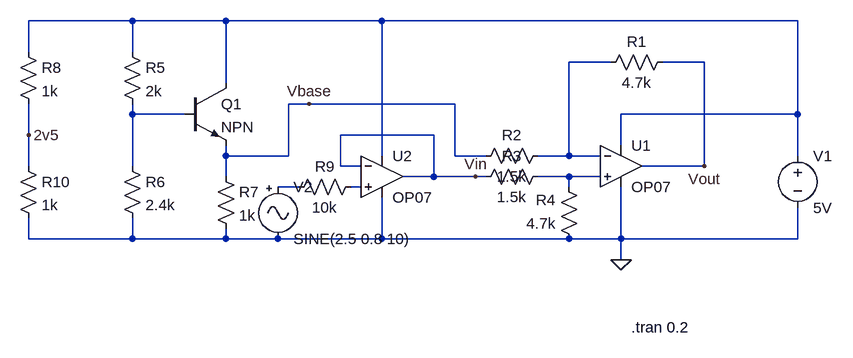
[diagram p0: schematic current_sensor_amp.asc]
current_sensor_amp.asc, the LTspice schematic file:
Version 4
SHEET 1 880 680
WIRE -592 -176 -752 -176
WIRE -448 -176 -592 -176
WIRE -208 -176 -448 -176
WIRE 432 -176 -208 -176
WIRE -752 -128 -752 -176
WIRE -592 -128 -592 -176
WIRE 144 -112 80 -112
WIRE 288 -112 224 -112
WIRE -448 -80 -448 -176
WIRE -320 -48 -352 -48
WIRE -96 -48 -320 -48
WIRE -592 -32 -592 -48
WIRE -512 -32 -592 -32
WIRE 432 -32 432 -176
WIRE 432 -32 160 -32
WIRE -752 0 -752 -48
WIRE -128 0 -272 0
WIRE 160 16 160 -32
WIRE -448 32 -448 16
WIRE -352 32 -352 -48
WIRE -352 32 -448 32
WIRE -208 32 -208 -176
WIRE -96 32 -96 -48
WIRE -48 32 -96 32
WIRE 80 32 80 -112
WIRE 80 32 32 32
WIRE 128 32 80 32
WIRE 432 32 432 -32
WIRE -752 48 -752 0
WIRE -592 48 -592 -32
WIRE -272 48 -272 0
WIRE -240 48 -272 48
WIRE 288 48 288 -112
WIRE 288 48 192 48
WIRE -448 64 -448 32
WIRE -128 64 -128 0
WIRE -128 64 -176 64
WIRE -64 64 -128 64
WIRE -48 64 -64 64
WIRE 80 64 32 64
WIRE 128 64 80 64
WIRE -336 80 -368 80
WIRE -240 80 -256 80
WIRE 80 80 80 64
WIRE -752 160 -752 128
WIRE -592 160 -592 128
WIRE -592 160 -752 160
WIRE -448 160 -448 144
WIRE -448 160 -592 160
WIRE -368 160 -448 160
WIRE -208 160 -208 96
WIRE -208 160 -368 160
WIRE 80 160 -208 160
WIRE 160 160 160 80
WIRE 160 160 80 160
WIRE 432 160 432 112
WIRE 432 160 160 160
WIRE 160 192 160 160
FLAG 160 192 0
FLAG 288 48 Vout
FLAG -64 64 Vin
FLAG -752 0 2v5
FLAG -320 -48 Vbase
SYMBOL Opamps\\OP07 160 -16 R0
SYMATTR InstName U1
SYMBOL res 240 -128 R90
WINDOW 0 0 56 VBottom 2
WINDOW 3 32 56 VTop 2
SYMATTR InstName R1
SYMATTR Value 4.7k
SYMBOL res 48 16 R90
WINDOW 0 0 56 VBottom 2
WINDOW 3 32 56 VTop 2
SYMATTR InstName R2
SYMATTR Value 1.5k
SYMBOL res 48 48 R90
WINDOW 0 0 56 VBottom 2
WINDOW 3 32 56 VTop 2
SYMATTR InstName R3
SYMATTR Value 1.5k
SYMBOL res 96 176 R180
WINDOW 0 36 76 Left 2
WINDOW 3 36 40 Left 2
SYMATTR InstName R4
SYMATTR Value 4.7k
SYMBOL voltage 432 16 R0
WINDOW 123 0 0 Left 0
WINDOW 39 0 0 Left 0
SYMATTR InstName V1
SYMATTR Value 5V
SYMBOL Misc\\signal -368 64 R0
WINDOW 123 0 0 Left 0
WINDOW 39 0 0 Left 0
SYMATTR InstName V2
SYMATTR Value SINE(2.5 0.8 10)
SYMBOL Opamps\\OP07 -208 0 R0
SYMATTR InstName U2
SYMBOL res -608 -144 R0
SYMATTR InstName R5
SYMATTR Value 2k
SYMBOL res -608 32 R0
SYMATTR InstName R6
SYMATTR Value 2.4k
SYMBOL res -240 64 R90
WINDOW 0 0 56 VBottom 2
WINDOW 3 32 56 VTop 2
SYMATTR InstName R9
SYMATTR Value 10k
SYMBOL res -464 48 R0
SYMATTR InstName R7
SYMATTR Value 1k
SYMBOL res -768 -144 R0
SYMATTR InstName R8
SYMATTR Value 1k
SYMBOL res -768 32 R0
SYMATTR InstName R10
SYMATTR Value 1k
SYMBOL npn2 -512 -80 R0
SYMATTR InstName Q1
TEXT 176 296 Left 2 !.tran 0.2

The netlist it stands for:
* current_sensor_amp.asc
XU1 N004 N002 N001 0 Vout LT1001  ; OP07, pins In+ In- V+ V- OUT
R1 Vout N002 4.7k
R2 N002 Vbase 1.5k
R3 N004 Vin 1.5k
R4 0 N004 4.7k
V1 N001 0 5V
V2 N005 0 SINE(2.5 0.8 10)
XU2 N006 Vin N001 0 Vin LT1001  ; OP07, pins In+ In- V+ V- OUT
R5 N001 N003 2k
R6 N003 0 2.4k
R9 N006 N005 10k
R7 Vbase 0 1k
R8 N001 2v5 1k
R10 2v5 0 1k
Q1 N001 N003 Vbase 0 NPN
.model NPN NPN
.model PNP PNP
.lib standard.bjt
.tran 0.2
.lib LTC.lib
.backanno
.end